# EAGLE board STM32F446 front pane - v3 (EAGLE 9.6.2), part 1 of 4
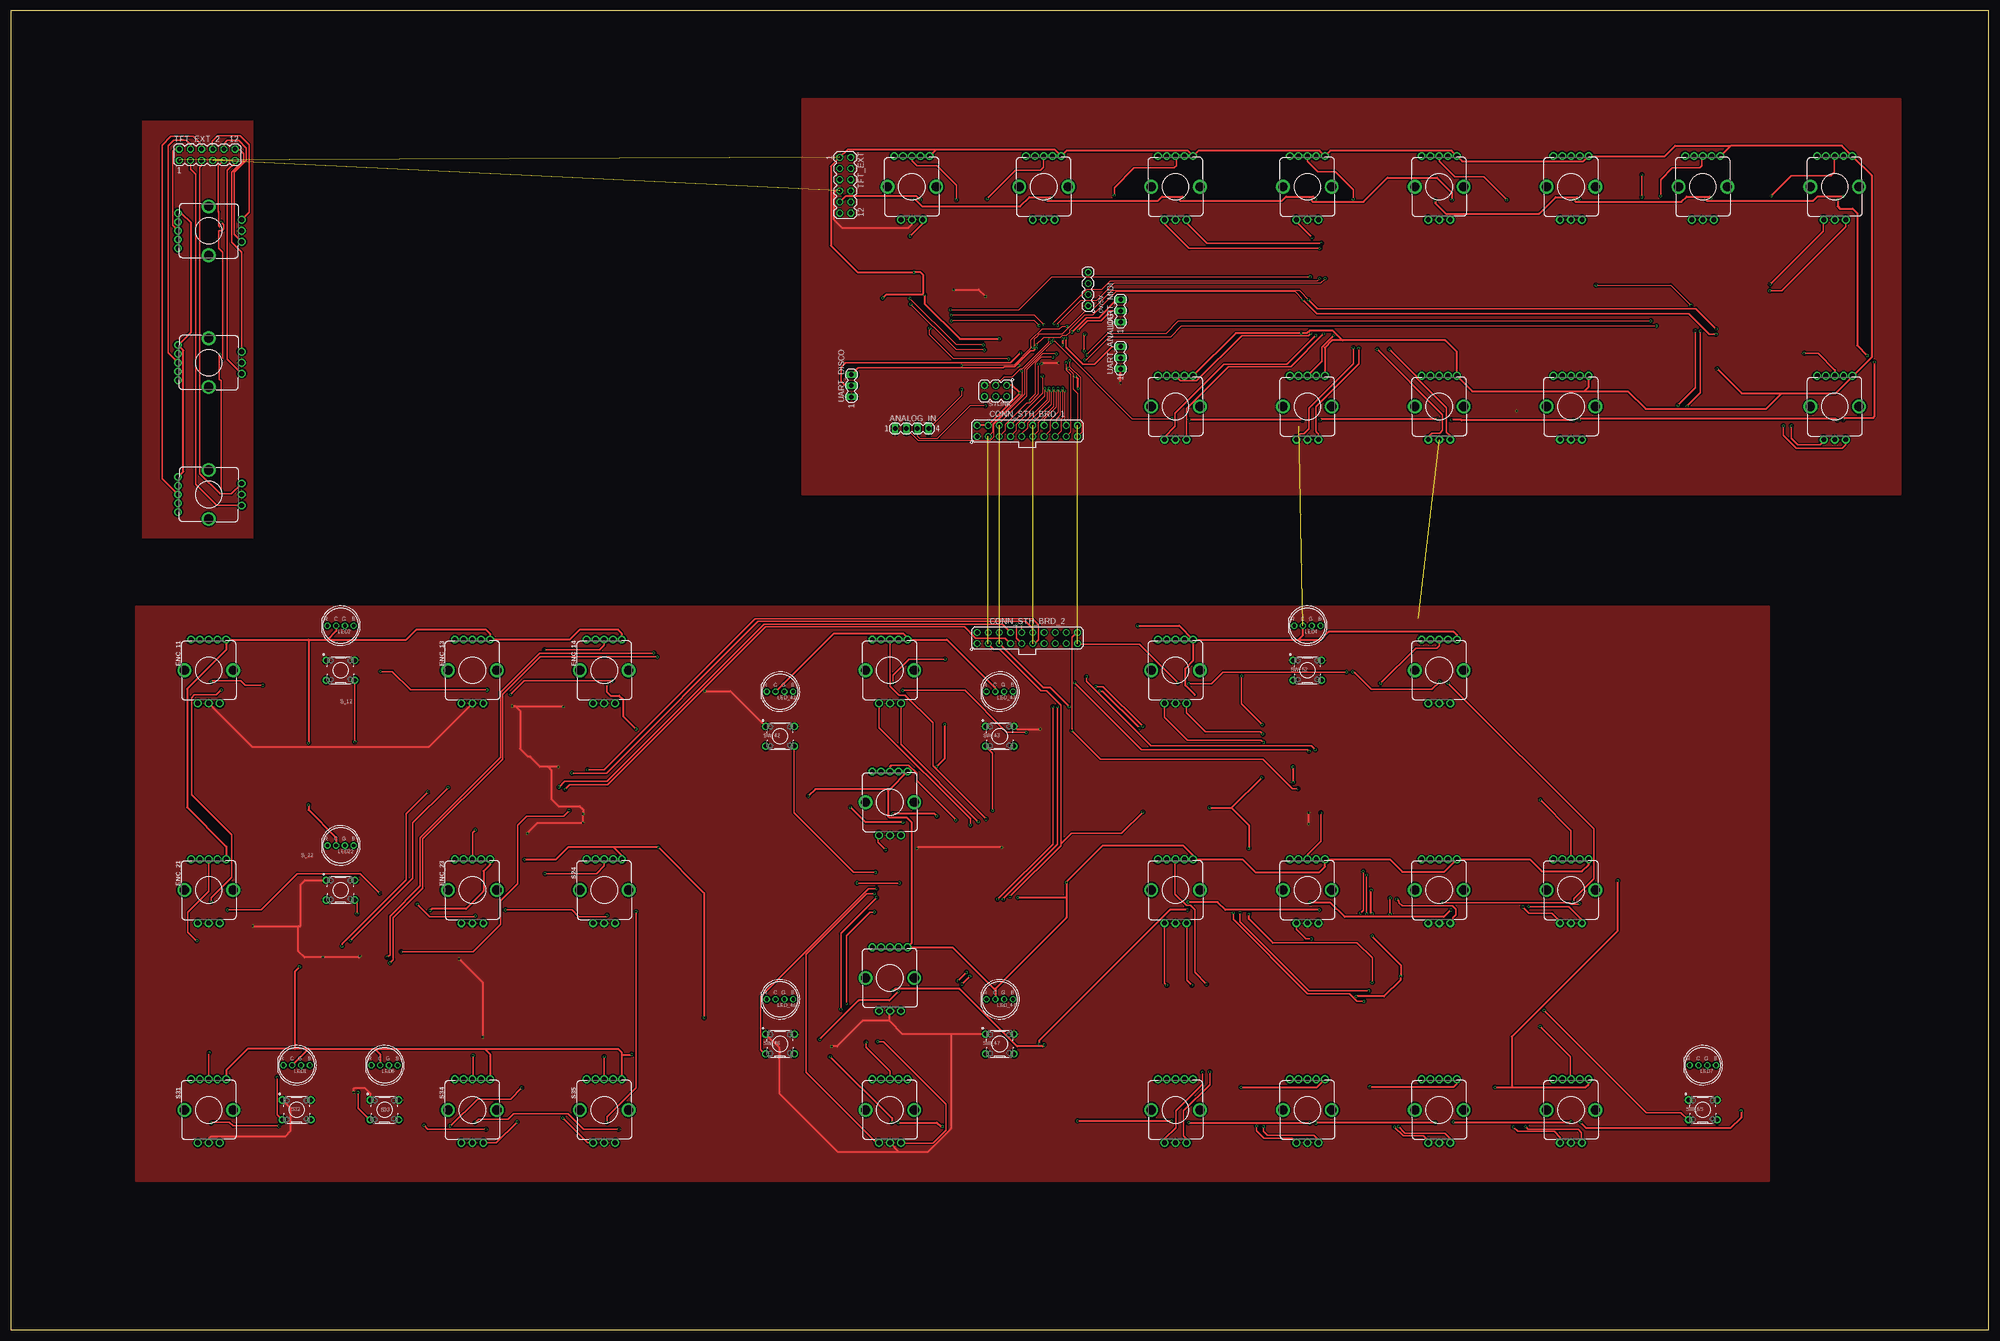
[diagram p15: board, top side]
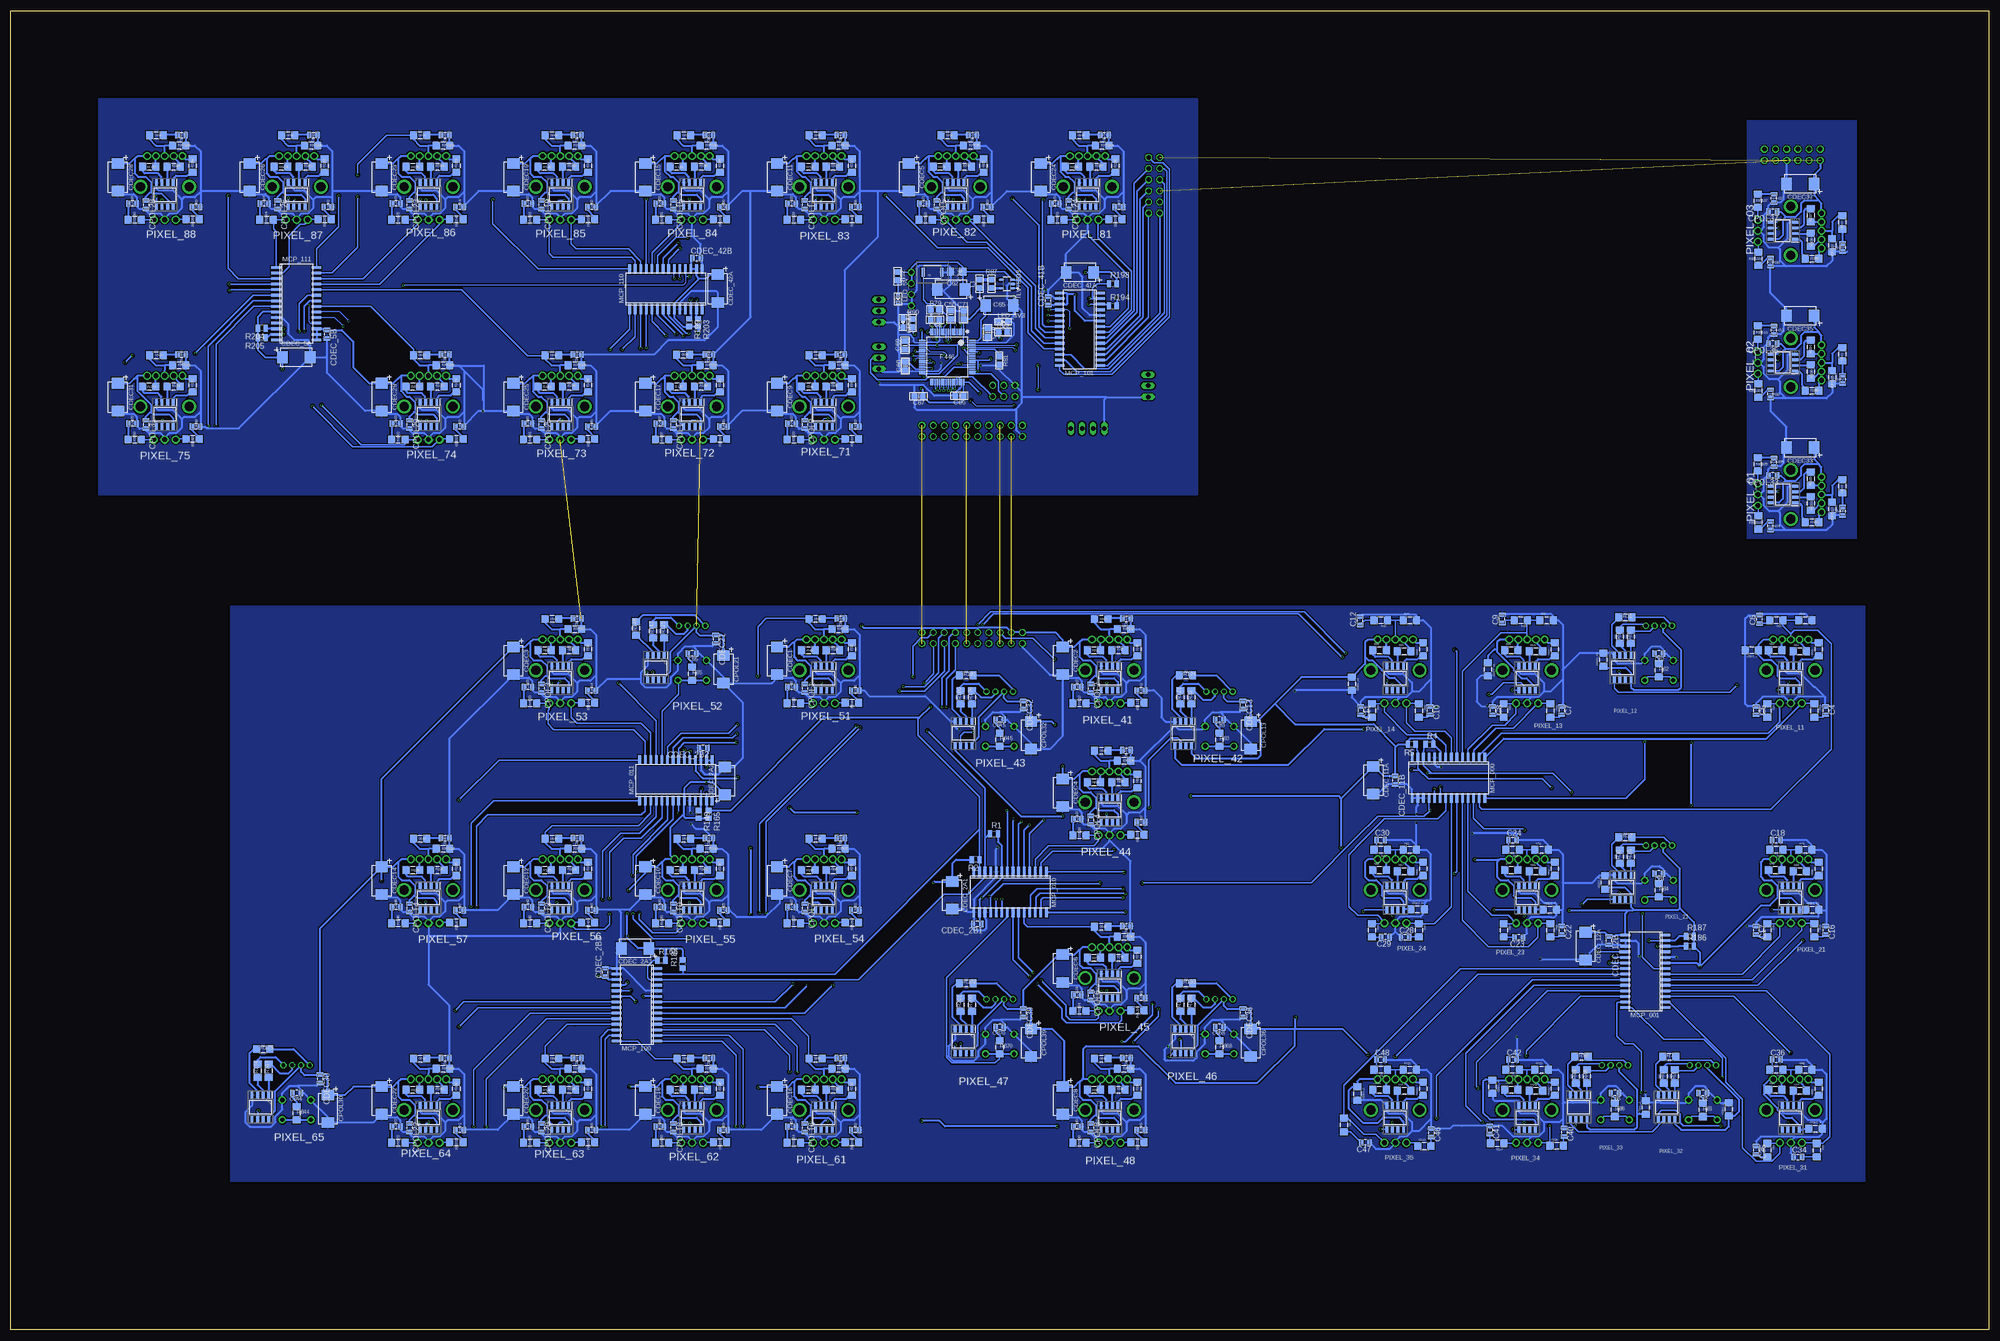
[diagram p16: board, bottom side, seen from below]

Size 450 x 300 mm. Coordinates in mm from the lower left corner, seen from the top.
Outline: 0,0 450,0 450,300 0,300 0,0
Copper layers (1*16): Top 0.035559375mm / dielectric 1.6mm / Bottom 0.035559375mm
Design rules "jlcpcb2layer": minimum track width 5mil, minimum drill 12mil, track to track 5mil, track to pad 5mil, pad to pad 5mil, via to via 5mil, smd to smd 5mil, copper to edge 8mil, drill to drill 6mil, minimum pad ring 5mil, minimum via ring 3mil, stop-mask expansion 2.5mil, vias tented up to drill 0mil, thermal gap 10mil

## Footprints (pad centres in the part's own frame; a part is rotated, then mirrored left to right if it is on the bottom)
MA04-1 = drill 1.016: 1 -3.81,0; 2 -1.27,0; 3 1.27,0; 4 3.81,0
MA04-1' = drill 1.016 long: 1 -3.81,0; 2 -1.27,0; 3 1.27,0; 4 3.81,0
0805-CAP = smd 1 x 1.5: 1 -0.95,0; 2 0.95,0
C0805 = smd 1.3 x 1.5: 1 -0.95,0; 2 0.95,0
CPOL2917 = smd 2.4 x 2.8: + -3.15,0; - 3.15,0
C1206 = smd 1.6 x 1.8: 1 -1.4,0; 2 1.4,0
1206 = smd 1.6 x 1.8: 1 -1.5,0; 2 1.5,0
MA10-2 = drill 1.016: 1 -11.43,-1.27; 2 -11.43,1.27; 3 -8.89,-1.27; 4 -8.89,1.27; 5 -6.35,-1.27; 6 -6.35,1.27; 7 -3.81,-1.27; 8 -3.81,1.27; 9 -1.27,-1.27; 10 -1.27,1.27; 11 1.27,-1.27; 12 1.27,1.27; 13 3.81,-1.27; 14 3.81,1.27; 15 6.35,-1.27; 16 6.35,1.27; 17 8.89,-1.27; 18 8.89,1.27; 19 11.43,-1.27; 20 11.43,1.27
ENCODER_LED_3 = drill 1.1 pad 1.778: 1 -4,7; 2 -2,7; 3 0,7; 4 2,7; 5 4,7 | drill 1.1 pad 1.8: A -2.5,-7.5; B 2.5,-7.5; C 0,-7.5 | drill 2.1: M1 -5.55,0; M2 5.55,0
QFP50P1200X1200X160-64N = smd 1.5 x 0.3: 1 -5.7,3.75; 2 -5.7,3.25; 3 -5.7,2.75; 4 -5.7,2.25; 5 -5.7,1.75; 6 -5.7,1.25; 7 -5.7,0.75; 8 -5.7,0.25; 9 -5.7,-0.25; 10 -5.7,-0.75; 11 -5.7,-1.25; 12 -5.7,-1.75; 13 -5.7,-2.25; 14 -5.7,-2.75; 15 -5.7,-3.25; 16 -5.7,-3.75; 33 5.7,-3.75; 34 5.7,-3.25; 35 5.7,-2.75; 36 5.7,-2.25; 37 5.7,-1.75; 38 5.7,-1.25; 39 5.7,-0.75; 40 5.7,-0.25; 41 5.7,0.25; 42 5.7,0.75; 43 5.7,1.25; 44 5.7,1.75; 45 5.7,2.25; 46 5.7,2.75; 47 5.7,3.25; 48 5.7,3.75 | smd 0.3 x 1.5: 17 -3.75,-5.7; 18 -3.25,-5.7; 19 -2.75,-5.7; 20 -2.25,-5.7; 21 -1.75,-5.7; 22 -1.25,-5.7; 23 -0.75,-5.7; 24 -0.25,-5.7; 25 0.25,-5.7; 26 0.75,-5.7; 27 1.25,-5.7; 28 1.75,-5.7; 29 2.25,-5.7; 30 2.75,-5.7; 31 3.25,-5.7; 32 3.75,-5.7; 49 3.75,5.7; 50 3.25,5.7; 51 2.75,5.7; 52 2.25,5.7; 53 1.75,5.7; 54 1.25,5.7; 55 0.75,5.7; 56 0.25,5.7; 57 -0.25,5.7; 58 -0.75,5.7; 59 -1.25,5.7; 60 -1.75,5.7; 61 -2.25,5.7; 62 -2.75,5.7; 63 -3.25,5.7; 64 -3.75,5.7
0805-LED = smd 1.2 x 1.2: A -1.05,0; C 1.05,0
L0805 = smd 1.3 x 1.5: 1 -0.95,0; 2 0.95,0
LED4-2.0-D8.0MM = drill 0.85 pad 1.4: 1 3,0; 2 1,0; 3 -1,0; 4 -3,0
0603-LED = smd 0.8 x 1: A 0.825,0; C -0.825,0
SOIC-28 = smd 2.2 x 0.6: 1 -4.6,8.255; 2 -4.6,6.985; 3 -4.6,5.715; 4 -4.6,4.445; 5 -4.6,3.175; 6 -4.6,1.905; 7 -4.6,0.635; 8 -4.6,-0.635; 9 -4.6,-1.905; 10 -4.6,-3.175; 11 -4.6,-4.445; 12 -4.6,-5.715; 13 -4.6,-6.985; 14 -4.6,-8.255; 15 4.6,-8.255; 16 4.6,-6.985; 17 4.6,-5.715; 18 4.6,-4.445; 19 4.6,-3.175; 20 4.6,-1.905; 21 4.6,-0.635; 22 4.6,0.635; 23 4.6,1.905; 24 4.6,3.175; 25 4.6,4.445; 26 4.6,5.715; 27 4.6,6.985; 28 4.6,8.255
SOIC127P600X175-8N = smd 1.528 x 0.65: 1 -2.711,1.905; 2 -2.711,0.635; 3 -2.711,-0.635; 4 -2.711,-1.905; 5 2.711,-1.905; 6 2.711,-0.635; 7 2.711,0.635; 8 2.711,1.905
R0805 = smd 1.016 x 1.422: 1 -0.889,0; 2 0.889,0
R0805' = smd 1.3 x 1.5: 1 -0.95,0; 2 0.95,0
SKRKAEE020 = smd 0.8 x 2: 1 -2.1,0; 2 2.1,0
B3F-1000 = drill 1 pad 1.6: 1 -3.25,2.25; 2 3.25,2.25; 3 -3.25,-2.25; 4 3.25,-2.25
MA03-2 = drill 1.016: 1 -2.54,-1.27; 2 -2.54,1.27; 3 0,-1.27; 4 0,1.27; 5 2.54,-1.27; 6 2.54,1.27
MA06-2 = drill 1.016 octagon: 1 -6.35,-1.27; 2 -6.35,1.27; 3 -3.81,-1.27; 4 -3.81,1.27; 5 -1.27,-1.27; 6 -1.27,1.27; 7 1.27,-1.27; 8 1.27,1.27; 9 3.81,-1.27; 10 3.81,1.27; 11 6.35,-1.27; 12 6.35,1.27
SOT95P280X145-5N = smd 1.21 x 0.59: 1 -1.255,0.95; 2 -1.255,0; 3 -1.255,-0.95; 4 1.255,-0.95; 5 1.255,0.95
MA03-1 = drill 1.016 long: 1 -2.54,0; 2 0,0; 3 2.54,0

## Placement (x,y rotation side)
0V/5V  [MA04-1]  245.1,236.75 90 top
ANALOG_IN  [MA04-1']  205,205 0 top
C4  10n  [0805-CAP]  37.13,140.86 270 bottom
C5  10n  [0805-CAP]  52.87,140.86 270 bottom
C6  10n  [0805-CAP]  52.08,161.63 90 bottom
C7  10n  [0805-CAP]  97.13,140.86 270 bottom
C8  10n  [0805-CAP]  112.87,140.86 270 bottom
C9  10n  [0805-CAP]  110.63,161.7 90 bottom
C10  10n  [0805-CAP]  127.13,140.86 270 bottom
C11  10n  [0805-CAP]  142.87,140.86 270 bottom
C12  10n  [0805-CAP]  143.01,161.29 90 bottom
C16  10n  [0805-CAP]  37.13,90.86 270 bottom
C17  10n  [0805-CAP]  52.87,90.86 270 bottom
C18  10n  [0805-CAP]  48.3,111.43 0 bottom
C22  10n  [0805-CAP]  97.13,90.86 270 bottom
C23  10n  [0805-CAP]  106.88,89.25 180 bottom
C24  10n  [0805-CAP]  108.3,111.43 0 bottom
C28  10n  [0805-CAP]  132.77,89.28 0 bottom
C29  10n  [0805-CAP]  137.24,89.28 180 bottom
C30  10n  [0805-CAP]  138.3,111.43 0 bottom
C34  10n  [0805-CAP]  43.4,39.33 0 bottom
C35  10n  [0805-CAP]  52.87,40.86 270 bottom
C36  10n  [0805-CAP]  48.3,61.43 0 bottom
C40  10n  [0805-CAP]  96.62,44.92 270 bottom
C41  10n  [0805-CAP]  113.51,45.43 270 bottom
C42  10n  [0805-CAP]  108.3,61.43 0 bottom
C46  10n  [0805-CAP]  126.87,44.79 270 bottom
C47  10n  [0805-CAP]  141.77,42.54 180 bottom
C48  10n  [0805-CAP]  138.3,61.43 0 bottom
C55  0.1uF  [C0805]  236.1,230.89 270 bottom
C60  2.2uF  [C0805]  246.48,219.24 90 bottom
C62  10u  [CPOL2917]  236.05,236.65 180 bottom
C65  100 uF  [CPOL2917]  225.07,233.02 0 bottom
C66  0.1uF  [C0805]  234.19,212.46 0 bottom
C67  0.1uF  [C0805]  243.46,212.38 0 bottom
C68  0.1uF  [C0805]  239.72,229.78 180 bottom
C69  0.1uF  [C0805]  246.55,223.96 90 bottom
C70  0.1uF  [C0805]  227.77,226.86 90 bottom
C71  1.0uF  [C0805]  233.22,230.83 270 bottom
C76  1u  [C1206]  234.81,240.69 0 bottom
CB1  10n  [0805-CAP]  65,53.81 180 bottom
CB2  10n  [0805-CAP]  75,153.81 180 bottom
CB3  10n  [0805-CAP]  175,138.81 180 bottom
CB4  10n  [0805-CAP]  75,103.81 180 bottom
CB5  10n  [0805-CAP]  295,153.81 180 bottom
CB6  10n  [0805-CAP]  85,53.81 180 bottom
CB8  10n  [0805-CAP]  257.89,145.43 180 bottom
CB9  10n  [0805-CAP]  272.37,146.19 180 bottom
CB10  10n  [0805-CAP]  261.19,161.81 0 bottom
CB11  10n  [0805-CAP]  192.89,145.43 180 bottom
CB12  10n  [0805-CAP]  207.37,146.19 180 bottom
CB13  10n  [0805-CAP]  196.19,161.81 0 bottom
CB14  10n  [0805-CAP]  317.89,145.43 180 bottom
CB15  10n  [0805-CAP]  332.37,146.19 180 bottom
CB16  10n  [0805-CAP]  321.19,161.81 0 bottom
CB17  10n  [0805-CAP]  192.89,115.43 180 bottom
CB18  10n  [0805-CAP]  207.37,116.19 180 bottom
CB19  10n  [0805-CAP]  196.19,131.81 0 bottom
CB20  10n  [0805-CAP]  227.89,255.43 180 bottom
CB21  10n  [0805-CAP]  242.37,256.19 180 bottom
CB22  10n  [0805-CAP]  231.19,271.81 0 bottom
CB23  10n  [0805-CAP]  192.89,75.43 180 bottom
CB24  10n  [0805-CAP]  207.37,76.19 180 bottom
CB25  10n  [0805-CAP]  196.19,91.81 0 bottom
CB26  10n  [0805-CAP]  257.89,95.43 180 bottom
CB27  10n  [0805-CAP]  272.37,96.19 180 bottom
CB28  10n  [0805-CAP]  261.19,111.81 0 bottom
CB29  10n  [0805-CAP]  192.89,45.43 180 bottom
CB30  10n  [0805-CAP]  207.37,46.19 180 bottom
CB31  10n  [0805-CAP]  196.19,61.81 0 bottom
CB32  10n  [0805-CAP]  257.89,205.43 180 bottom
CB33  10n  [0805-CAP]  272.37,206.19 180 bottom
CB34  10n  [0805-CAP]  261.19,221.81 0 bottom
CB35  10n  [0805-CAP]  287.89,95.43 180 bottom
CB36  10n  [0805-CAP]  302.37,96.19 180 bottom
CB37  10n  [0805-CAP]  291.19,111.81 0 bottom
CB38  10n  [0805-CAP]  257.89,255.43 180 bottom
CB39  10n  [0805-CAP]  272.37,256.19 180 bottom
CB40  10n  [0805-CAP]  261.19,271.81 0 bottom
CB41  10n  [0805-CAP]  317.89,95.43 180 bottom
CB42  10n  [0805-CAP]  332.37,96.19 180 bottom
CB43  10n  [0805-CAP]  321.19,111.81 0 bottom
CB44  10n  [0805-CAP]  385,53.81 180 bottom
CB45  10n  [0805-CAP]  225,138.81 180 bottom
CB47  10n  [0805-CAP]  347.89,95.43 180 bottom
CB48  10n  [0805-CAP]  362.37,96.19 180 bottom
CB49  10n  [0805-CAP]  351.19,111.81 0 bottom
CB50  10n  [0805-CAP]  287.89,255.43 180 bottom
CB51  10n  [0805-CAP]  302.37,256.19 180 bottom
CB52  10n  [0805-CAP]  291.19,271.81 0 bottom
CB53  10n  [0805-CAP]  257.89,45.43 180 bottom
CB54  10n  [0805-CAP]  272.37,46.19 180 bottom
CB55  10n  [0805-CAP]  261.19,61.81 0 bottom
CB56  10n  [0805-CAP]  287.89,205.43 180 bottom
CB57  10n  [0805-CAP]  302.37,206.19 180 bottom
CB58  10n  [0805-CAP]  291.19,221.81 0 bottom
CB59  10n  [0805-CAP]  287.89,45.43 180 bottom
CB60  10n  [0805-CAP]  302.37,46.19 180 bottom
CB61  10n  [0805-CAP]  291.19,61.81 0 bottom
CB62  10n  [0805-CAP]  317.89,255.43 180 bottom
CB63  10n  [0805-CAP]  332.37,256.19 180 bottom
CB64  10n  [0805-CAP]  321.19,271.81 0 bottom
CB65  10n  [0805-CAP]  317.89,45.43 180 bottom
CB66  10n  [0805-CAP]  332.37,46.19 180 bottom
CB67  10n  [0805-CAP]  321.19,61.81 0 bottom
CB68  10n  [0805-CAP]  175,68.81 180 bottom
CB70  10n  [0805-CAP]  225,68.81 180 bottom
CB71  10n  [0805-CAP]  347.89,45.43 180 bottom
CB72  10n  [0805-CAP]  362.37,46.19 180 bottom
CB73  10n  [0805-CAP]  351.19,61.81 0 bottom
CB74  10n  [0805-CAP]  347.89,255.43 180 bottom
CB75  10n  [0805-CAP]  362.37,256.19 180 bottom
CB76  10n  [0805-CAP]  351.19,271.81 0 bottom
CB77  10n  [0805-CAP]  197.89,255.43 180 bottom
CB78  10n  [0805-CAP]  212.37,256.19 180 bottom
CB79  10n  [0805-CAP]  201.19,271.81 0 bottom
CB80  10n  [0805-CAP]  317.89,205.43 180 bottom
CB81  10n  [0805-CAP]  332.37,206.19 180 bottom
CB82  10n  [0805-CAP]  321.19,221.81 0 bottom
CB83  10n  [0805-CAP]  377.89,255.43 180 bottom
CB84  10n  [0805-CAP]  392.37,256.19 180 bottom
CB85  10n  [0805-CAP]  381.19,271.81 0 bottom
CB89  10n  [0805-CAP]  407.89,255.43 180 bottom
CB90  10n  [0805-CAP]  422.37,256.19 180 bottom
CB91  10n  [0805-CAP]  411.19,271.81 0 bottom
CB92  10n  [0805-CAP]  347.89,205.43 180 bottom
CB93  10n  [0805-CAP]  362.37,206.19 180 bottom
CB94  10n  [0805-CAP]  351.19,221.81 0 bottom
CB98  10n  [0805-CAP]  407.89,205.43 180 bottom
CB99  10n  [0805-CAP]  422.37,206.19 180 bottom
CB100  10n  [0805-CAP]  411.19,221.81 0 bottom
CB104  10n  [0805-CAP]  49.57,182.89 90 bottom
CB105  10n  [0805-CAP]  48.81,197.37 90 bottom
CB106  10n  [0805-CAP]  33.19,186.19 270 bottom
CB110  10n  [0805-CAP]  49.57,212.89 90 bottom
CB111  10n  [0805-CAP]  48.81,227.37 90 bottom
CB112  10n  [0805-CAP]  33.19,216.19 270 bottom
CB116  10n  [0805-CAP]  49.57,242.89 90 bottom
CB117  10n  [0805-CAP]  48.81,257.37 90 bottom
CB118  10n  [0805-CAP]  33.19,246.19 270 bottom
CDEC1  10u  [CPOL2917]  275.67,152.16 270 bottom
CDEC2  10u  [CPOL2917]  210.67,152.16 270 bottom
CDEC3  10u  [CPOL2917]  335.67,152.16 270 bottom
CDEC4  10u  [CPOL2917]  210.67,122.16 270 bottom
CDEC5  10u  [CPOL2917]  245.67,262.16 270 bottom
CDEC6  10u  [CPOL2917]  210.67,82.16 270 bottom
CDEC7  10u  [CPOL2917]  275.67,102.16 270 bottom
CDEC8  10u  [CPOL2917]  210.67,52.16 270 bottom
CDEC9  10u  [CPOL2917]  275.67,212.16 270 bottom
CDEC10  10u  [CPOL2917]  305.67,102.16 270 bottom
CDEC11  10u  [CPOL2917]  275.67,262.16 270 bottom
CDEC12  10u  [CPOL2917]  335.67,102.16 270 bottom
CDEC13  100n  [0805-CAP]  169.67,142.11 270 bottom
CDEC14  10u  [CPOL2917]  365.67,102.16 270 bottom
CDEC15  10u  [CPOL2917]  305.67,262.16 270 bottom
CDEC16  10u  [CPOL2917]  275.67,52.16 270 bottom
CDEC17  10u  [CPOL2917]  305.67,212.16 270 bottom
CDEC18  10u  [CPOL2917]  305.67,52.16 270 bottom
CDEC19  10u  [CPOL2917]  335.67,262.16 270 bottom
CDEC20  10u  [CPOL2917]  335.67,52.16 270 bottom
CDEC21  100n  [0805-CAP]  289.67,157.11 270 bottom
CDEC22  10u  [CPOL2917]  365.67,52.16 270 bottom
CDEC23  10u  [CPOL2917]  365.67,262.16 270 bottom
CDEC24  10u  [CPOL2917]  215.67,262.16 270 bottom
CDEC25  10u  [CPOL2917]  335.67,212.16 270 bottom
CDEC26  10u  [CPOL2917]  395.67,262.16 270 bottom
CDEC28  10u  [CPOL2917]  425.67,262.16 270 bottom
CDEC29  10u  [CPOL2917]  365.67,212.16 270 bottom
CDEC30  100n  [0805-CAP]  379.67,57.11 270 bottom
CDEC31  10u  [CPOL2917]  425.67,212.16 270 bottom
CDEC32  100n  [0805-CAP]  219.67,142.11 270 bottom
CDEC33  10u  [CPOL2917]  42.84,200.67 180 bottom
CDEC35  10u  [CPOL2917]  42.84,230.67 180 bottom
CDEC36  100n  [0805-CAP]  169.67,72.11 270 bottom
CDEC37  10u  [CPOL2917]  42.84,260.67 180 bottom
CDEC39  100n  [0805-CAP]  219.67,72.11 270 bottom
CDEC_1  100n  [1206]  59.05,50.16 90 bottom
CDEC_2  100n  [1206]  77.98,50.55 90 bottom
CDEC_2A1  10u  [CPOL2917]  235.84,98.81 270 bottom
CDEC_2A2  10u  [CPOL2917]  287.53,124.84 90 bottom
CDEC_2A3  10u  [CPOL2917]  307.98,86.74 180 bottom
CDEC_2B1  100n  [0805-CAP]  230.12,92.33 180 bottom
CDEC_2B2  100n  [0805-CAP]  292.48,132.33 180 bottom
CDEC_2B3  100n  [0805-CAP]  314.71,81.28 90 bottom
CDEC_3  100n  [1206]  39.37,45.72 0 bottom
CDEC_4  100n  [1206]  112.9,55.24 270 bottom
CDEC_5  100n  [1206]  143.64,53.72 270 bottom
CDEC_5A  10u  [CPOL2917]  385.06,221.23 0 bottom
CDEC_5B  100n  [0805-CAP]  378.08,226.44 270 bottom
CDEC_6  100n  [1206]  129.92,95.63 0 bottom
CDEC_7  100n  [1206]  99.82,95.5 0 bottom
CDEC_8  100n  [1206]  87.25,101.73 90 bottom
CDEC_9  100n  [1206]  53.85,154.56 180 bottom
CDEC_10  100n  [1206]  87.63,152.4 90 bottom
CDEC_11  100n  [1206]  113.92,150.24 270 bottom
CDEC_11A  10u  [CPOL2917]  140,125 270 bottom
CDEC_11B  100n  [0805-CAP]  135,125 270 bottom
CDEC_12  100n  [1206]  40.13,95.5 0 bottom
CDEC_12A  10u  [CPOL2917]  91.69,87.26 270 bottom
CDEC_12B  100n  [0805-CAP]  86.4,88.53 270 bottom
CDEC_13  100n  [1206]  144.91,146.94 270 bottom
CDEC_41A  10u  [CPOL2917]  206.76,240.54 180 bottom
CDEC_41B  100n  [0805-CAP]  214,234.06 90 bottom
CDEC_42A  10u  [CPOL2917]  289.18,236.85 270 bottom
CDEC_42B  100n  [0805-CAP]  294,243.84 0 bottom
CONN_STH_BRD_1  [MA10-2]  231.27,204.47 0 top
CONN_STH_BRD_2  [MA10-2]  231.27,157.35 0 top
CPOL1  100n  [0805-CAP]  269.32,145.94 270 bottom
CPOL2  100n  [0805-CAP]  204.32,145.94 270 bottom
CPOL3  100n  [0805-CAP]  329.32,145.94 270 bottom
CPOL4  100n  [0805-CAP]  204.32,115.94 270 bottom
CPOL5  100n  [0805-CAP]  239.32,255.94 270 bottom
CPOL6  100n  [0805-CAP]  204.32,75.94 270 bottom
CPOL7  100n  [0805-CAP]  269.32,95.94 270 bottom
CPOL8  100n  [0805-CAP]  204.32,45.94 270 bottom
CPOL9  100n  [0805-CAP]  269.32,205.94 270 bottom
CPOL10  100n  [0805-CAP]  299.32,95.94 270 bottom
CPOL11  100n  [0805-CAP]  269.32,255.94 270 bottom
CPOL12  100n  [0805-CAP]  329.32,95.94 270 bottom
CPOL13  10u  [CPOL2917]  167.89,135.25 270 bottom
CPOL14  100n  [0805-CAP]  359.32,95.94 270 bottom
CPOL15  100n  [0805-CAP]  299.32,255.94 270 bottom
CPOL16  100n  [0805-CAP]  269.32,45.94 270 bottom
CPOL17  100n  [0805-CAP]  299.32,205.94 270 bottom
CPOL18  100n  [0805-CAP]  299.32,45.94 270 bottom
CPOL19  100n  [0805-CAP]  329.32,255.94 270 bottom
CPOL20  100n  [0805-CAP]  329.32,45.94 270 bottom
CPOL21  10u  [CPOL2917]  287.89,150.25 270 bottom
CPOL22  100n  [0805-CAP]  359.32,45.94 270 bottom
CPOL23  100n  [0805-CAP]  359.32,255.94 270 bottom
CPOL24  100n  [0805-CAP]  209.32,255.94 270 bottom
CPOL25  100n  [0805-CAP]  329.32,205.94 270 bottom
CPOL26  100n  [0805-CAP]  389.32,255.94 270 bottom
CPOL28  100n  [0805-CAP]  419.32,255.94 270 bottom
CPOL29  100n  [0805-CAP]  359.32,205.94 270 bottom
CPOL30  10u  [CPOL2917]  377.89,50.25 270 bottom
CPOL31  100n  [0805-CAP]  419.32,205.94 270 bottom
CPOL32  10u  [CPOL2917]  217.89,135.25 270 bottom
CPOL33  100n  [0805-CAP]  49.06,194.32 180 bottom
CPOL35  100n  [0805-CAP]  49.06,224.32 180 bottom
CPOL36  10u  [CPOL2917]  167.89,65.25 270 bottom
CPOL37  100n  [0805-CAP]  49.06,254.32 180 bottom
CPOL39  10u  [CPOL2917]  217.89,65.25 270 bottom
ENC_01  [ENCODER_LED_3]  45,190 90 top
ENC_02  [ENCODER_LED_3]  45,220 90 top
ENC_3  [ENCODER_LED_3]  45,250 90 top
ENC_11  [ENCODER_LED_3]  45,150 0 top
ENC_13  [ENCODER_LED_3]  105,150 0 top
ENC_14  [ENCODER_LED_3]  135,150 0 top
ENC_21  [ENCODER_LED_3]  45,100 0 top
ENC_23  [ENCODER_LED_3]  105,100 0 top
ENC_41  [ENCODER_LED_3]  200,150 0 top
ENC_44  [ENCODER_LED_3]  200,120 0 top
ENC_45  [ENCODER_LED_3]  200,80 0 top
ENC_48  [ENCODER_LED_3]  200,50 0 top
ENC_51  [ENCODER_LED_3]  265,150 0 top
ENC_53  [ENCODER_LED_3]  325,150 0 top
ENC_54  [ENCODER_LED_3]  265,100 0 top
ENC_55  [ENCODER_LED_3]  295,100 0 top
ENC_56  [ENCODER_LED_3]  325,100 0 top
ENC_57  [ENCODER_LED_3]  355,100 0 top
ENC_61  [ENCODER_LED_3]  265,50 0 top
ENC_62  [ENCODER_LED_3]  295,50 0 top
ENC_63  [ENCODER_LED_3]  325,50 0 top
ENC_64  [ENCODER_LED_3]  355,50 0 top
ENC_71  [ENCODER_LED_3]  265,210 0 top
ENC_72  [ENCODER_LED_3]  295,210 0 top
ENC_73  [ENCODER_LED_3]  325,210 0 top
ENC_74  [ENCODER_LED_3]  355,210 0 top
ENC_75  [ENCODER_LED_3]  415,210 0 top
ENC_81  [ENCODER_LED_3]  205,260 0 top
ENC_82  [ENCODER_LED_3]  235,260 0 top
ENC_83  [ENCODER_LED_3]  265,260 0 top
ENC_84  [ENCODER_LED_3]  295,260 0 top
ENC_85  [ENCODER_LED_3]  325,260 0 top
ENC_86  [ENCODER_LED_3]  355,260 0 top
ENC_87  [ENCODER_LED_3]  385,260 0 top
ENC_88  [ENCODER_LED_3]  415,260 0 top
F446  STM32F446RCT7  [QFP50P1200X1200X160-64N]  236.97,221.26 270 bottom
GREEN  [0805-LED]  247.01,229.13 270 bottom
L1  1 uH  [L0805]  229.63,237.94 270 bottom
LED1  CZXR-80RGB03-A  [LED4-2.0-D8.0MM]  65,60.16 180 top
LED2  CZXR-80RGB03-A  [LED4-2.0-D8.0MM]  75,160.16 180 top
LED4  CZXR-80RGB03-A  [LED4-2.0-D8.0MM]  295,160.16 180 top
LED6  CZXR-80RGB03-A  [LED4-2.0-D8.0MM]  85,60.16 180 top
LED7  CZXR-80RGB03-A  [LED4-2.0-D8.0MM]  385,60.16 180 top
LED22  CZXR-80RGB03-A  [LED4-2.0-D8.0MM]  75,110.16 180 top
LED_3V3  [0805-LED]  224.27,229.26 0 bottom
LED_5V  [0603-LED]  248.15,234.47 90 bottom
LED_42  CZXR-80RGB03-A  [LED4-2.0-D8.0MM]  175,145.16 180 top
LED_43  CZXR-80RGB03-A  [LED4-2.0-D8.0MM]  225,145.16 180 top
LED_46  CZXR-80RGB03-A  [LED4-2.0-D8.0MM]  175,75.16 180 top
LED_47  CZXR-80RGB03-A  [LED4-2.0-D8.0MM]  225,75.16 180 top
MCP_000  MCP23017  [SOIC-28]  122.87,125.54 270 bottom
MCP_001  MCP23017  [SOIC-28]  78.05,81.53 180 bottom
MCP_010  MCP23017  [SOIC-28]  222.63,99.57 270 bottom
MCP_011  MCP23017  [SOIC-28]  298.7,124.97 90 bottom
MCP_100  MCP23017  [SOIC-28]  307.59,73.91 180 bottom
MCP_101  MCP23017  [SOIC-28]  206.76,227.58 180 bottom
MCP_110  MCP23017  [SOIC-28]  300.99,236.73 90 bottom
MCP_111  MCP23017  [SOIC-28]  385.06,233.43 0 bottom
PIXE_82  NEOPIXEL-TLC59731DR  [SOIC127P600X175-8N]  235,258.22 270 bottom
PIXEL_01  NEOPIXEL-TLC59731DR  [SOIC127P600X175-8N]  46.78,190 180 bottom
PIXEL_02  NEOPIXEL-TLC59731DR  [SOIC127P600X175-8N]  46.78,220 180 bottom
PIXEL_03  NEOPIXEL-TLC59731DR  [SOIC127P600X175-8N]  46.78,250 180 bottom
PIXEL_11  NEOPIXEL-TLC59731DR  [SOIC127P600X175-8N]  45,148.22 270 bottom
PIXEL_12  NEOPIXEL-TLC59731DR  [SOIC127P600X175-8N]  83.25,150.63 270 bottom
PIXEL_13  NEOPIXEL-TLC59731DR  [SOIC127P600X175-8N]  105,148.22 270 bottom
PIXEL_14  NEOPIXEL-TLC59731DR  [SOIC127P600X175-8N]  135,148.22 270 bottom
PIXEL_21  NEOPIXEL-TLC59731DR  [SOIC127P600X175-8N]  45,98.22 270 bottom
PIXEL_22  NEOPIXEL-TLC59731DR  [SOIC127P600X175-8N]  83.25,100.64 270 bottom
PIXEL_23  NEOPIXEL-TLC59731DR  [SOIC127P600X175-8N]  105,98.22 270 bottom
PIXEL_24  NEOPIXEL-TLC59731DR  [SOIC127P600X175-8N]  135,98.22 270 bottom
PIXEL_31  NEOPIXEL-TLC59731DR  [SOIC127P600X175-8N]  45,48.22 270 bottom
PIXEL_32  NEOPIXEL-TLC59731DR  [SOIC127P600X175-8N]  73.25,50.63 270 bottom
PIXEL_33  NEOPIXEL-TLC59731DR  [SOIC127P600X175-8N]  93.25,50.63 270 bottom
PIXEL_34  NEOPIXEL-TLC59731DR  [SOIC127P600X175-8N]  105,48.22 270 bottom
PIXEL_35  NEOPIXEL-TLC59731DR  [SOIC127P600X175-8N]  135,48.22 270 bottom
PIXEL_41  NEOPIXEL-TLC59731DR  [SOIC127P600X175-8N]  200,148.22 270 bottom
PIXEL_42  NEOPIXEL-TLC59731DR  [SOIC127P600X175-8N]  183.25,135.63 270 bottom
PIXEL_43  NEOPIXEL-TLC59731DR  [SOIC127P600X175-8N]  233.25,135.63 270 bottom
PIXEL_44  NEOPIXEL-TLC59731DR  [SOIC127P600X175-8N]  200,118.22 270 bottom
PIXEL_45  NEOPIXEL-TLC59731DR  [SOIC127P600X175-8N]  200,78.22 270 bottom
PIXEL_46  NEOPIXEL-TLC59731DR  [SOIC127P600X175-8N]  183.25,65.64 270 bottom
PIXEL_47  NEOPIXEL-TLC59731DR  [SOIC127P600X175-8N]  233.25,65.64 270 bottom
PIXEL_48  NEOPIXEL-TLC59731DR  [SOIC127P600X175-8N]  200,48.22 270 bottom
PIXEL_51  NEOPIXEL-TLC59731DR  [SOIC127P600X175-8N]  265,148.22 270 bottom
PIXEL_52  NEOPIXEL-TLC59731DR  [SOIC127P600X175-8N]  303.25,150.63 270 bottom
PIXEL_53  NEOPIXEL-TLC59731DR  [SOIC127P600X175-8N]  325,148.22 270 bottom
PIXEL_54  NEOPIXEL-TLC59731DR  [SOIC127P600X175-8N]  265,98.22 270 bottom
PIXEL_55  NEOPIXEL-TLC59731DR  [SOIC127P600X175-8N]  295,98.22 270 bottom
PIXEL_56  NEOPIXEL-TLC59731DR  [SOIC127P600X175-8N]  325,98.22 270 bottom
PIXEL_57  NEOPIXEL-TLC59731DR  [SOIC127P600X175-8N]  355,98.22 270 bottom
PIXEL_61  NEOPIXEL-TLC59731DR  [SOIC127P600X175-8N]  265,48.22 270 bottom
PIXEL_62  NEOPIXEL-TLC59731DR  [SOIC127P600X175-8N]  295,48.22 270 bottom
PIXEL_63  NEOPIXEL-TLC59731DR  [SOIC127P600X175-8N]  325,48.22 270 bottom
PIXEL_64  NEOPIXEL-TLC59731DR  [SOIC127P600X175-8N]  355,48.22 270 bottom
PIXEL_65  NEOPIXEL-TLC59731DR  [SOIC127P600X175-8N]  393.25,50.63 270 bottom
PIXEL_71  NEOPIXEL-TLC59731DR  [SOIC127P600X175-8N]  265,208.22 270 bottom
PIXEL_72  NEOPIXEL-TLC59731DR  [SOIC127P600X175-8N]  295,208.22 270 bottom
PIXEL_73  NEOPIXEL-TLC59731DR  [SOIC127P600X175-8N]  325,208.22 270 bottom
PIXEL_74  NEOPIXEL-TLC59731DR  [SOIC127P600X175-8N]  355,208.22 270 bottom
PIXEL_75  NEOPIXEL-TLC59731DR  [SOIC127P600X175-8N]  415,208.22 270 bottom
PIXEL_81  NEOPIXEL-TLC59731DR  [SOIC127P600X175-8N]  205,258.22 270 bottom
PIXEL_83  NEOPIXEL-TLC59731DR  [SOIC127P600X175-8N]  265,258.22 270 bottom
PIXEL_84  NEOPIXEL-TLC59731DR  [SOIC127P600X175-8N]  295,258.22 270 bottom
PIXEL_85  NEOPIXEL-TLC59731DR  [SOIC127P600X175-8N]  325,258.22 270 bottom
PIXEL_86  NEOPIXEL-TLC59731DR  [SOIC127P600X175-8N]  355,258.22 270 bottom
PIXEL_87  NEOPIXEL-TLC59731DR  [SOIC127P600X175-8N]  385,258.22 270 bottom
PIXEL_88  NEOPIXEL-TLC59731DR  [SOIC127P600X175-8N]  415,258.22 270 bottom
R1  1k  [R0805]  226.31,112.78 0 bottom
R2  1k  [R0805]  230.5,106.93 180 bottom
R3  100  [1206]  71.35,57.62 90 bottom
R4  1k  [R0805]  127.19,133.16 0 bottom
R5  1k  [R0805]  131.25,133.16 180 bottom
R6  100  [1206]  73.89,57.62 90 bottom
R7  100  [1206]  72.62,62.06 0 bottom
R8  100  [1206]  81.35,157.62 90 bottom
R9  100  [1206]  83.89,157.62 90 bottom
R10  100  [1206]  38.65,154.83 90 bottom
R11  100  [1206]  42.97,154.32 0 bottom
R12  100  [1206]  48.56,154.57 0 bottom
R13  10k  [1206]  41.7,161.43 0 bottom
R14  470  [1206]  39.67,140.86 270 bottom
R15  470  [1206]  50.33,140.86 270 bottom
R16  470  [1206]  48.3,161.43 180 bottom
R17  100  [1206]  98.65,154.83 90 bottom
R18  100  [1206]  102.97,154.32 0 bottom
R19  100  [1206]  108.56,154.57 0 bottom
R20  10k  [1206]  100.56,161.43 0 bottom
R21  470  [1206]  99.67,140.86 270 bottom
R22  470  [1206]  110.33,140.86 270 bottom
R23  470  [1206]  106.4,161.43 180 bottom
R24  100  [1206]  128.65,154.83 90 bottom
R25  100  [1206]  132.97,154.32 0 bottom
R26  100  [1206]  138.56,154.57 0 bottom
R27  10k  [1206]  131.7,161.43 0 bottom
R28  470  [1206]  129.67,140.86 270 bottom
R29  470  [1206]  140.33,140.86 270 bottom
R30  470  [1206]  138.3,161.43 180 bottom
R31  100  [1206]  82.62,162.06 0 bottom
R32  100  [1206]  181.35,143.89 90 bottom
R33  100  [1206]  258.65,154.83 90 bottom
R34  100  [1206]  262.97,154.57 0 bottom
R35  100  [1206]  81.35,107.62 90 bottom
R36  100  [1206]  83.89,107.62 90 bottom
R37  100  [1206]  82.62,112.06 0 bottom
R38  100  [1206]  38.65,104.83 90 bottom
R39  100  [1206]  42.97,104.32 0 bottom
R40  100  [1206]  48.56,104.57 0 bottom
R41  10k  [1206]  41.7,109.14 0 bottom
R42  470  [1206]  39.67,90.86 270 bottom
R43  470  [1206]  50.33,90.86 270 bottom
R44  470  [1206]  48.3,109.14 180 bottom
R45  100  [1206]  268.56,154.57 0 bottom
R46  100  [1206]  193.65,154.83 90 bottom
R47  100  [1206]  197.97,154.57 0 bottom
R48  100  [1206]  91.35,57.62 90 bottom
R49  100  [1206]  93.89,57.62 90 bottom
R50  100  [1206]  92.62,62.06 0 bottom
R51  100  [1206]  203.56,154.57 0 bottom
R52  100  [1206]  98.65,104.83 90 bottom
R53  100  [1206]  102.97,104.32 0 bottom
R54  100  [1206]  108.56,104.57 0 bottom
R55  10k  [1206]  101.7,109.14 0 bottom
R56  470  [1206]  99.67,90.86 270 bottom
R57  470  [1206]  110.33,90.86 270 bottom
R58  470  [1206]  108.3,109.14 180 bottom
R59  100  [1206]  318.65,154.83 90 bottom
R60  100  [1206]  322.97,154.57 0 bottom
R61  100  [1206]  328.56,154.57 0 bottom
R62  100  [1206]  193.65,124.83 90 bottom
R63  100  [1206]  197.97,124.57 0 bottom
R64  100  [1206]  203.56,124.57 0 bottom
R65  100  [1206]  228.65,264.83 90 bottom
R66  100  [1206]  128.65,104.83 90 bottom
R67  100  [1206]  132.97,104.32 0 bottom
R68  100  [1206]  138.56,104.57 0 bottom
R69  10k  [1206]  131.7,109.14 0 bottom
R70  470  [1206]  129.67,90.86 270 bottom
R71  470  [1206]  140.33,90.86 270 bottom
R72  470  [1206]  138.3,109.14 180 bottom
R73  100  [1206]  232.97,264.57 0 bottom
R74  100  [1206]  238.56,264.57 0 bottom
R75  100  [1206]  193.65,84.83 90 bottom
R76  100  [1206]  197.97,84.57 0 bottom
R77  100  [1206]  203.56,84.57 0 bottom
R78  100  [1206]  258.65,104.83 90 bottom
R79  100k  [R0805']  239.77,232.05 0 bottom
R80  100  [1206]  262.97,104.57 0 bottom
R81  10K  [R0805']  225.12,220.48 270 bottom
R82  100  [1206]  38.65,54.83 90 bottom
R83  100  [1206]  268.56,104.57 0 bottom
R84  100  [1206]  42.97,54.32 0 bottom
R85  100  [1206]  48.56,54.57 0 bottom
R86  100  [1206]  193.65,54.83 90 bottom
R87  1  [R0805']  226.88,237.94 270 bottom
R88  10k  [1206]  41.7,59.14 0 bottom
R89  470  [1206]  39.03,40.86 270 bottom
R90  1k  [R0805']  244.85,229 90 bottom
R91  470  [1206]  50.33,40.86 270 bottom
R92  470  [R0805']  248.28,239.67 270 bottom
R93  470  [1206]  48.3,59.14 180 bottom
R94  100  [1206]  197.97,54.57 0 bottom
R95  1k  [R0805']  224.27,226.97 0 bottom
R96  100  [1206]  203.56,54.57 0 bottom
R97  100  [1206]  258.65,214.83 90 bottom
R98  100  [1206]  262.97,214.57 0 bottom
R99  100  [1206]  268.56,214.57 0 bottom
R100  100  [1206]  288.65,104.83 90 bottom
R101  100  [1206]  292.97,104.57 0 bottom
R102  100  [1206]  98.65,54.83 90 bottom
R103  100  [1206]  102.97,54.32 0 bottom
R104  100  [1206]  108.56,54.57 0 bottom
R105  10k  [1206]  101.7,59.14 0 bottom
R106  470  [1206]  98.26,41.81 0 bottom
R107  470  [1206]  111.8,42.39 180 bottom
R108  470  [1206]  108.3,59.14 180 bottom
R109  100  [1206]  298.56,104.57 0 bottom
R110  100  [1206]  258.65,264.83 90 bottom
R111  100  [1206]  262.97,264.57 0 bottom
R112  100  [1206]  268.56,264.57 0 bottom
R113  100  [1206]  318.65,104.83 90 bottom
R114  100  [1206]  322.97,104.57 0 bottom
R115  100  [1206]  328.56,104.57 0 bottom
R116  100  [1206]  128.65,54.83 90 bottom
R117  100  [1206]  132.97,54.32 0 bottom
R118  100  [1206]  138.56,54.57 0 bottom
R119  10k  [1206]  131.7,59.14 0 bottom
R120  470  [1206]  128.36,41.78 0 bottom
R121  470  [1206]  146.68,46.57 270 bottom
R122  470  [1206]  138.3,59.14 180 bottom
R123  100  [1206]  183.89,143.89 90 bottom
R124  100  [1206]  182.62,148.84 0 bottom
R125  100  [1206]  301.35,158.89 90 bottom
R126  100  [1206]  348.65,104.83 90 bottom
R127  100  [1206]  352.97,104.57 0 bottom
R128  100  [1206]  358.56,104.57 0 bottom
R129  100  [1206]  288.65,264.83 90 bottom
R130  100  [1206]  292.97,264.57 0 bottom
R131  100  [1206]  298.56,264.57 0 bottom
R132  100  [1206]  258.65,54.83 90 bottom
R133  100  [1206]  262.97,54.57 0 bottom
R134  100  [1206]  268.56,54.57 0 bottom
R135  100  [1206]  288.65,214.83 90 bottom
R136  100  [1206]  292.97,214.57 0 bottom
R137  100  [1206]  298.56,214.57 0 bottom
R138  100  [1206]  288.65,54.83 90 bottom
R139  100  [1206]  292.97,54.57 0 bottom
R140  100  [1206]  298.56,54.57 0 bottom
R141  100  [1206]  318.65,264.83 90 bottom
R142  100  [1206]  322.97,264.57 0 bottom
R143  100  [1206]  328.56,264.57 0 bottom
R144  100  [1206]  318.65,54.83 90 bottom
R145  100  [1206]  322.97,54.57 0 bottom
R146  100  [1206]  328.56,54.57 0 bottom
R147  100  [1206]  303.89,158.89 90 bottom
R148  100  [1206]  307.73,159.53 90 bottom
R149  1k  [R0805]  293.5,117.22 270 bottom
R150  100  [1206]  348.65,54.83 90 bottom
R151  100  [1206]  352.97,54.57 0 bottom
R152  100  [1206]  358.56,54.57 0 bottom
R153  100  [1206]  348.65,264.83 90 bottom
R154  100  [1206]  352.97,264.57 0 bottom
R155  100  [1206]  358.56,264.57 0 bottom
R156  100  [1206]  198.65,264.83 90 bottom
R157  100  [1206]  202.97,264.57 0 bottom
R158  100  [1206]  208.56,264.57 0 bottom
R159  100  [1206]  318.65,214.83 90 bottom
R160  100  [1206]  322.97,214.57 0 bottom
R161  100  [1206]  328.56,214.57 0 bottom
R162  100  [1206]  378.65,264.83 90 bottom
R163  100  [1206]  382.97,264.57 0 bottom
R164  100  [1206]  388.56,264.57 0 bottom
R165  1k  [R0805]  291.21,117.22 270 bottom
R166  1k  [R0805]  302.01,84.07 0 bottom
R167  100  [1206]  391.35,58.89 90 bottom
R168  100  [1206]  408.65,264.83 90 bottom
R169  100  [1206]  412.97,264.57 0 bottom
R170  100  [1206]  418.56,264.57 0 bottom
R171  100  [1206]  348.65,214.83 90 bottom
R172  100  [1206]  352.97,214.57 0 bottom
R173  100  [1206]  358.56,214.57 0 bottom
R174  100  [1206]  393.89,58.89 90 bottom
R175  100  [1206]  392.62,63.84 0 bottom
R176  100  [1206]  231.35,143.89 90 bottom
R177  100  [1206]  408.65,214.83 90 bottom
R178  100  [1206]  412.97,214.57 0 bottom
R179  100  [1206]  418.56,214.57 0 bottom
R180  100  [1206]  233.89,143.89 90 bottom
R181  100  [1206]  232.62,148.84 0 bottom
R182  1k  [R0805]  297.18,83.19 90 bottom
R183  100  [1206]  40.17,183.65 0 bottom
R184  100  [1206]  40.43,187.97 270 bottom
R185  100  [1206]  40.43,193.56 270 bottom
R186  1k  [R0805]  67.94,87.25 0 bottom
R187  1k  [R0805]  67.94,89.53 0 bottom
R188  100  [1206]  181.35,73.89 90 bottom
R189  100  [1206]  40.17,213.65 0 bottom
R190  100  [1206]  40.43,217.97 270 bottom
R191  100  [1206]  40.43,223.56 270 bottom
R192  100  [1206]  183.89,73.89 90 bottom
R193  100  [1206]  182.62,78.84 0 bottom
R194  1k  [R0805]  199.26,232.92 0 bottom
R195  100  [1206]  40.17,243.65 0 bottom
R196  100  [1206]  40.43,247.97 270 bottom
R197  100  [1206]  40.43,253.56 270 bottom
R198  1k  [R0805]  199.26,238 0 bottom
R199  1k  [R0805]  295.66,229.11 270 bottom
R200  100  [1206]  231.35,73.89 90 bottom
R201  100  [1206]  233.89,73.89 90 bottom
R202  100  [1206]  232.62,78.84 0 bottom
R203  1k  [R0805]  293.62,229.11 270 bottom
R204  1k  [R0805]  392.94,227.84 180 bottom
R205  1k  [R0805]  392.94,225.68 180 bottom
RB1  470  [1206]  65,50 90 bottom
RB2  470  [1206]  75,150 90 bottom
RB3  470  [1206]  175,134.24 90 bottom
RB4  470  [1206]  75,100 90 bottom
RB5  470  [1206]  295,149.24 90 bottom
RB6  470  [1206]  85,50 90 bottom
RB8  470  [1206]  258.65,142.63 0 bottom
RB9  470  [1206]  271.86,142.51 180 bottom
RB10  470  [1206]  266.9,161.68 0 bottom
RB11  470  [1206]  193.65,142.63 0 bottom
RB12  470  [1206]  206.86,142.51 180 bottom
RB13  470  [1206]  201.91,161.68 0 bottom
RB14  470  [1206]  318.65,142.63 0 bottom
RB15  470  [1206]  331.86,142.51 180 bottom
RB16  470  [1206]  326.9,161.68 0 bottom
RB17  470  [1206]  193.65,112.63 0 bottom
RB18  470  [1206]  206.86,112.51 180 bottom
RB19  470  [1206]  201.91,131.68 0 bottom
RB20  470  [1206]  228.65,252.63 0 bottom
RB21  470  [1206]  241.86,252.51 180 bottom
RB22  470  [1206]  236.91,271.68 0 bottom
RB23  470  [1206]  193.65,72.63 0 bottom
RB24  470  [1206]  206.86,72.51 180 bottom
RB25  470  [1206]  201.91,91.68 0 bottom
RB26  470  [1206]  258.65,92.63 0 bottom
RB27  470  [1206]  271.86,92.51 180 bottom
RB28  470  [1206]  266.9,111.68 0 bottom
RB29  470  [1206]  193.65,42.63 0 bottom
RB30  470  [1206]  206.86,42.51 180 bottom
RB31  470  [1206]  201.91,61.68 0 bottom
RB32  470  [1206]  258.65,202.63 0 bottom
RB33  470  [1206]  271.86,202.51 180 bottom
RB34  470  [1206]  266.9,221.68 0 bottom
RB35  470  [1206]  288.65,92.63 0 bottom
RB36  470  [1206]  301.86,92.51 180 bottom
RB37  470  [1206]  296.9,111.68 0 bottom
RB38  470  [1206]  258.65,252.63 0 bottom
RB39  470  [1206]  271.86,252.51 180 bottom
RB40  470  [1206]  266.9,271.68 0 bottom
RB41  470  [1206]  318.65,92.63 0 bottom
RB42  470  [1206]  331.86,92.51 180 bottom
RB43  470  [1206]  326.9,111.68 0 bottom
RB44  470  [1206]  385,49.24 90 bottom
RB45  470  [1206]  225,134.24 90 bottom
RB47  470  [1206]  348.65,92.63 0 bottom
RB48  470  [1206]  361.86,92.51 180 bottom
RB49  470  [1206]  356.9,111.68 0 bottom
RB50  470  [1206]  288.65,252.63 0 bottom
RB51  470  [1206]  301.86,252.51 180 bottom
RB52  470  [1206]  296.9,271.68 0 bottom
RB53  470  [1206]  258.65,42.63 0 bottom
RB54  470  [1206]  271.86,42.51 180 bottom
RB55  470  [1206]  266.9,61.68 0 bottom
RB56  470  [1206]  288.65,202.63 0 bottom
RB57  470  [1206]  301.86,202.51 180 bottom
RB58  470  [1206]  297.03,221.81 0 bottom
RB59  470  [1206]  288.65,42.63 0 bottom
RB60  470  [1206]  301.86,42.51 180 bottom
RB61  470  [1206]  296.9,61.68 0 bottom
RB62  470  [1206]  318.65,252.63 0 bottom
RB63  470  [1206]  331.86,252.51 180 bottom
RB64  470  [1206]  326.9,271.68 0 bottom
RB65  470  [1206]  318.65,42.63 0 bottom
RB66  470  [1206]  331.86,42.51 180 bottom
RB67  470  [1206]  326.9,61.68 0 bottom
RB68  470  [1206]  175,64.24 90 bottom
RB70  470  [1206]  225,64.24 90 bottom
RB71  470  [1206]  348.65,42.63 0 bottom
RB72  470  [1206]  361.86,42.51 180 bottom
RB73  470  [1206]  356.9,61.68 0 bottom
RB74  470  [1206]  348.65,252.63 0 bottom
RB75  470  [1206]  361.86,252.51 180 bottom
RB76  470  [1206]  356.9,271.68 0 bottom
RB77  470  [1206]  198.65,252.63 0 bottom
RB78  470  [1206]  211.86,252.51 180 bottom
RB79  470  [1206]  206.91,271.68 0 bottom
RB80  470  [1206]  318.65,202.63 0 bottom
RB81  470  [1206]  331.86,202.51 180 bottom
RB82  470  [1206]  326.9,221.68 0 bottom
RB83  470  [1206]  378.65,252.63 0 bottom
RB84  470  [1206]  391.86,252.51 180 bottom
RB85  470  [1206]  386.9,271.68 0 bottom
RB89  470  [1206]  408.65,252.63 0 bottom
RB90  470  [1206]  421.86,252.51 180 bottom
RB91  470  [1206]  416.9,271.68 0 bottom
RB92  470  [1206]  348.65,202.63 0 bottom
RB93  470  [1206]  361.86,202.51 180 bottom
RB94  470  [1206]  356.9,221.68 0 bottom
RB98  470  [1206]  408.65,202.63 0 bottom
RB99  470  [1206]  421.86,202.51 180 bottom
RB100  470  [1206]  416.9,221.68 0 bottom
RB104  470  [1206]  52.37,183.65 270 bottom
RB105  470  [1206]  52.49,196.86 90 bottom
RB106  470  [1206]  33.32,191.91 270 bottom
RB110  470  [1206]  52.37,213.65 270 bottom
RB111  470  [1206]  52.49,226.86 90 bottom
RB112  470  [1206]  33.32,221.91 270 bottom
RB116  470  [1206]  52.37,243.65 270 bottom
RB117  470  [1206]  52.49,256.86 90 bottom
RB118  470  [1206]  33.32,251.91 270 bottom
RPD1  10k  [1206]  261.7,159.4 0 bottom
RPD2  10k  [1206]  196.7,159.4 0 bottom
RPD3  10k  [1206]  321.7,159.4 0 bottom
RPD4  10k  [1206]  196.7,129.4 0 bottom
RPD5  10k  [1206]  231.7,269.4 0 bottom
RPD6  10k  [1206]  196.7,89.4 0 bottom
RPD7  10k  [1206]  261.7,109.4 0 bottom
RPD8  10k  [1206]  196.7,59.4 0 bottom
RPD9  10k  [1206]  261.7,219.4 0 bottom
RPD10  10k  [1206]  291.7,109.4 0 bottom
RPD11  10k  [1206]  261.7,269.4 0 bottom
RPD12  10k  [1206]  321.7,109.4 0 bottom
RPD14  10k  [1206]  351.7,109.4 0 bottom
RPD15  10k  [1206]  291.7,269.4 0 bottom
RPD16  10k  [1206]  261.7,59.4 0 bottom
RPD17  10k  [1206]  291.7,219.4 0 bottom
RPD18  10k  [1206]  291.7,59.4 0 bottom
RPD19  10k  [1206]  321.7,269.4 0 bottom
RPD20  10k  [1206]  321.7,59.4 0 bottom
RPD22  10k  [1206]  351.7,59.4 0 bottom
RPD23  10k  [1206]  351.7,269.4 0 bottom
RPD24  10k  [1206]  201.7,269.4 0 bottom
RPD25  10k  [1206]  321.7,219.4 0 bottom
RPD26  10k  [1206]  381.7,269.4 0 bottom
RPD28  10k  [1206]  411.7,269.4 0 bottom
RPD29  10k  [1206]  351.7,219.4 0 bottom
RPD31  10k  [1206]  411.7,219.4 0 bottom
RPD33  10k  [1206]  35.6,186.7 270 bottom
RPD35  10k  [1206]  35.6,216.7 270 bottom
RPD37  10k  [1206]  35.6,246.7 270 bottom
S2  SWITCH-SKRKAEE020  [SKRKAEE020]  240.28,240.56 180 bottom
S24  [ENCODER_LED_3]  135,100 0 top
S31  [ENCODER_LED_3]  45,50 0 top
S32  B3F-1000  [B3F-1000]  65,50 0 top
S33  B3F-1000  [B3F-1000]  85,50 0 top
S34  [ENCODER_LED_3]  105,50 0 top
S35  [ENCODER_LED_3]  135,50 0 top
S_12  B3F-1000  [B3F-1000]  75,150 0 top
S_22  B3F-1000  [B3F-1000]  75,100 0 top
STLINK  75867-331LF  [MA03-2]  224.07,213.57 180 top
SW_42  B3F-1000  [B3F-1000]  175,135 0 top
SW_43  B3F-1000  [B3F-1000]  225,135 0 top
SW_46  B3F-1000  [B3F-1000]  175,65 0 top
SW_47  B3F-1000  [B3F-1000]  225,65 0 top
SW_52  B3F-1000  [B3F-1000]  295,150 0 top
SW_65  B3F-1000  [B3F-1000]  385,50 0 top
TFT_EXT  [MA06-2]  189.87,260.35 270 top
TFT_EXT_2  [MA06-2]  44.65,267.29 0 top
TLV75533  TLV75533PDBVR  [SOT95P280X145-5N]  223.38,237.89 180 bottom
UART_ANALOG  [MA03-1]  252.48,221.11 90 top
UART_DISCO  [MA03-1]  191.26,214.76 90 top
UART_MIDI  [MA03-1]  252.48,231.78 90 top

## Tracks (layer width: path | path; a pad name or v marks a point on that pad's centre or on a via)
3V3  (via drill 0.35)  (2 unrouted)
  Top 0.406: ENC_23.5 109,105.78 107.54,104.32 107.54,99.75 103.55,95.76 95.76,95.76 v95.38,95.38 | LED2.2 74,158.96 72.04,157 | 67.69,157 ENC_11.5 49,154.72 40.08,145.8 40.08,118.8 49,109.88 ENC_21.5 | 67.69,157 72.04,157 | 72.04,157 89.94,157 92.2,159.26 108.08,159.26 109,158.34 ENC_13.5 127.16,157 129.41,159.26 138.18,159.26 139,158.43 ENC_14.5 | 137.16,109.73 126.75,109.73 123.95,106.93 v116.84,106.93 | 137.16,109.73 139,107.89 S24.5 | 137.16,109.73 v147.32,109.73 157.73,99.31 v157.73,70.99 | LED1.2 67.72,63.88 | LED6.2 84,62.69 82.8,63.88 | 67.72,63.88 82.8,63.88 | 67.72,63.88 64.64,63.88 | 64.64,63.88 53.85,63.88 49,59.03 S31.5 | 82.8,63.88 107.82,63.88 | S34.5 109,62.7 107.82,63.88 | 107.82,63.88 138.18,63.88 139,63.06 139,62.48 | 139,62.48 S35.5 | 64.64,63.88 64.64,81.53 v65.66,82.55 | STLINK.1 226.65,214.88 227.84,214.88 v229.62,213.11 229.62,212.98 CONN_STH_BRD_1.4 | v239.27,225.35 v239.27,224.01 v239.26,224 | v279.91,55.12 297.12,55.12 ENC_62.5 | v309.25,55.24 328.3,55.24 329,55.95 ENC_63.5 | v337.69,55.12 341.5,55.12 | 341.5,55.12 358.27,55.12 359,55.85 ENC_64.5 | ENC_57.5 359,105.76 357.5,104.27 348.36,104.27 345.63,107 ENC_56.5 326.14,104.14 316.61,104.14 313.75,107 ENC_55.5 299,105.33 297.69,104.01 283.21,104.01 280.22,107 ENC_54.5 269,107.89 266.78,110.11 248.41,110.11 240.16,101.85 v240.16,101.73 240.16,98.3 | ENC_51.5 293.02,157 | LED4.2 294,157.98 293.02,157 | 293.02,157 298.07,157 299.82,158.75 328.3,158.75 329,158.04 ENC_53.5 | 358.01,213.49 359,214.47 ENC_74.5 | 419,216.79 ENC_75.5 | 419,216.79 423.42,221.21 423.42,262.58 ENC_88.5 416.63,269.37 391.37,269.37
  Top 0.406: ENC_87.5 391.37,269.37 | ENC_81.5 210.48,268.48 | 210.48,268.48 237.52,268.48 ENC_82.5 240.22,268.22 267.78,268.22 ENC_83.5 270.22,268.22 297.78,268.22 ENC_84.5 300.22,268.22 327.78,268.22 ENC_85.5 330.22,265.78 357.78,265.78 ENC_86.5 376.35,267 378.71,269.37 391.37,269.37 | ENC_3.5 38.76,254 40.97,251.79 40.97,226.97 ENC_02.5 39.22,222.78 39.22,195.22 ENC_01.5 | LED_43.2 224,145.95 212.95,157 ENC_41.5 204,157.44 203.07,158.37 187.21,158.37 LED_42.2 | 224,77.24 LED_47.2 | 224,77.24 214.24,87 ENC_45.5 204.89,87.89 204.89,115.48 203.83,116.54 199.86,116.54 199.56,116.85 199.56,122.56 199.98,122.98 | v212.47,137.67 212.47,129.92 v210.69,128.14 | ENC_44.5 199.98,122.98 | ENC_51.5 269,152.19 267.21,150.4 267.21,146.55 269.37,144.4 | v365.63,102.11 365.63,90.81 341.5,66.67 341.5,55.12 | 240.16,98.3 240.16,93.73 224,77.57 224,77.24 | v291.78,124.52 291.78,127.95 v291.72,128.02 | v309.75,89.53 309.75,89.41 316.23,82.93 v316.23,80.39 316.23,79.63 312.42,75.82 v306.07,75.82 | v309.75,94.61 309.5,94.87 v309.5,99.95 | 240.16,98.3 v229.11,98.3 | v207.9,235.46 207.65,235.71 207.65,239.9 207.01,240.54 v205.49,240.54 192.66,240.54 186.56,246.63 186.56,264.67 TFT_EXT.1 190.37,268.48 210.48,268.48 | v207.9,235.46 199.14,235.46 v198.37,234.7 | 419,216.79 415.19,212.98 402.92,212.98 | 358.01,213.49 367.97,213.49 371.99,209.47 399.41,209.47 402.92,212.98 | ENC_72.5 298.96,217.04 298.96,223.39 300.61,225.04 303.02,225.04 | 303.02,225.04 326.39,225.04 329,222.43 ENC_73.5 332.51,213.49 358.01,213.49 | v388.24,218.57 393.83,212.98 402.92,212.98 | 303.02,225.04 300.78,227.29 295.54,227.29 294.94,226.69 v293.62,226.69 278.69,226.69 ENC_71.5
  Top 0.406: CONN_STH_BRD_1.4 CONN_STH_BRD_1.2 | 222.76,206.12 CONN_STH_BRD_1.4 | v256.41,160.15 265.85,160.15 ENC_51.5 | v242.82,214.12 242.82,216.28 v242.19,216.92 | v207.9,235.46 207.9,233.43 215.9,225.43 v224.92,225.43 | v141.22,62.61 141.1,62.48 139,62.48 | 67.69,157 v67.69,133.48 | v67.69,119.38 67.69,118.24 74,111.93 LED22.2 | 199.98,122.98 183.05,122.98 v181.48,121.41
  Bottom 0.305: 234.59,224 233.22,225.37 F446.1 C71.2 | 234.59,224 v239.26,224 241.29,224 241.3,224.01 F446.19 245.55,224.01 246.45,224.91 | 233.22,213.34 233.22,213.49 | 233.22,213.49 233.22,215.52 | 233.22,215.52 F446.48 | C70.2 229.24,227.81 | C65.+ 228.22,230.66 229.24,229.64 229.24,227.81 | F446.64 229.92,225.01 229.24,225.69 229.24,227.81 | 239.22,225.4 F446.13 239.22,228.18 240.67,229.63 | v229.62,213.11 232.03,215.52 233.22,215.52 | F446.32 241.6,217.51 | 241.6,217.51 238.81,217.51 234.59,221.73 234.59,224 | v242.19,216.92 241.6,217.51 | 233.22,213.49 233.24,213.47 C66.2
  Bottom 0.406: L1.2 229.63,234.43 C65.+ 228.78,233.02 231.92,229.88 C71.2 | R79.1 240.67,232.01 C68.2 240.67,229.63 | 239.22,224.04 v239.26,224 | 246.45,224.91 C69.2 | C70.2 226.06,227.81 R95.1 225.22,225.73 v224.92,225.43 | MCP_000.9 124.77,131.64 R4.2 126.3,134.18 126.53,134.41 131.66,134.41 132.14,133.92 R5.2 134.3,133.16 134.81,132.65 | ENC_11.5 51.21,157 52.35,155.86 CDEC_9.1 52.35,153.54 51.1,152.29 49.32,152.29 48.05,151.02 48.05,148.73 47.54,148.22 43.98,148.22 43.09,147.33 PIXEL_11.8 | ENC_13.5 111.21,157 111.86,156.35 111.86,154.81 | ENC_14.5 141.21,157 141.86,156.35 141.86,153.05 | 141.86,153.05 141.1,152.29 140.17,152.29 138.05,150.17 138.05,150.01 136.39,148.35 135.14,148.35 133.09,146.31 PIXEL_14.8 | ENC_21.5 51.21,107 51.86,106.35 51.86,103.05 51.1,102.29 49.32,102.29 48.05,101.02 48.05,98.73 47.79,98.48 | 47.79,98.48 47.54,98.22 44.88,98.22 43.09,96.43 PIXEL_21.8 CDEC_12.1 | ENC_23.5 111.21,107 111.45,106.75 | 111.45,106.75 111.86,106.35 111.86,103.05 111.1,102.29 109.32,102.29 108.05,101.02 108.05,98.73 107.54,98.22 103.98,98.22 103.09,97.33 PIXEL_23.8 CDEC_7.1 | S24.5 141.21,107 141.86,106.35 141.86,103.05 141.1,102.29 139.32,102.29 138.05,101.02 138.05,98.73 137.54,98.22 133.98,98.22 133.09,97.33 PIXEL_24.8 132.97,95.63 CDEC_6.1 | PIXEL_34.8 103.09,47.33 103.6,47.84 113.51,47.84 115.03,49.37 115.03,56.35 114.38,57 113.16,57 CDEC_4.1 109.25,56.74 S34.5 | PIXEL_35.8 133.09,47.33 133.98,48.22 137.83,48.22 139.06,46.99 142.24,46.99 145.54,50.29 145.54,54.48 144.78,55.24 143.66,55.24 CDEC_5.1 143.64,56.52 143.15,57 S35.5 | LED2.2 74,158.63 69.92,154.56 69.92,146.19 70.56,145.56 80.72,145.56 81.35,146.19 PIXEL_12.8 81.35,149.42 82.55,150.62 87.35,150.62 CDEC_10.1
  Bottom 0.406: LED22.2 74,108.64 70.23,104.86 70.23,95.88 | 80.72,95.56 81.35,96.19 PIXEL_22.8 81.35,99.26 82.7,100.61 86.87,100.61 CDEC_8.1 | 80.72,95.56 70.56,95.56 70.23,95.88 | LED6.2 84,58.63 79.92,54.55 79.92,48.9 | 91.35,48.36 PIXEL_33.8 91.35,46.19 90.72,45.55 80.56,45.55 79.92,46.19 79.92,48.9 | LED1.2 64,59.52 56.74,52.27 56.74,49.66 57.74,48.66 CDEC_1.1 59.05,46.22 59.85,45.43 69.92,45.43 71.35,46.86 PIXEL_32.8 71.35,48.36 | 134.81,132.65 135,132.46 CDEC_11B.1 137.6,125.95 139.8,128.15 CDEC_11A.+ 147.32,120.83 | v95.38,95.38 81.92,95.38 | 81.92,95.38 80.89,95.38 80.72,95.56 | CDEC_2.1 79.77,49.05 79.92,48.9 | 81.92,95.38 82.65,94.64 MCP_001.15 84.84,89.78 85.15,89.48 CDEC_12B.1 87.33,90.41 CDEC_12A.+ | 47.79,98.48 49.75,96.52 51.69,96.52 v65.66,82.55 | v116.84,106.93 111.63,106.93 111.45,106.75 | CDEC_3.1 42.16,45.72 42.37,45.51 PIXEL_31.8 43.09,46.56 44.76,48.22 46.26,48.22 48.05,50.01 48.05,50.4 51.19,53.53 51.19,55.61 49.8,57 S31.5 | CDEC_11.1 113.79,151.87 113.79,153.42 112.39,154.81 111.86,154.81 | 141.86,153.05 141.86,151.49 CDEC_13.1 156.36,148.44 162.43,142.37 | 239.22,225.4 v239.27,225.35 | ENC_41.5 206.21,157 206.86,156.35 | 206.86,156.35 206.86,153.05 206.1,152.29 204.32,152.29 203.05,151.02 203.05,148.73 | 203.05,148.73 202.54,148.22 198.98,148.22 198.09,147.33 PIXEL_41.8 | CPOL2.1 204.32,147.71 203.3,148.73 203.05,148.73 | 206.86,156.35 206.99,156.35 208.03,155.31 CDEC2.+ 210.67,156.95 212.34,158.62 CONN_STH_BRD_2.2 CONN_STH_BRD_2.4 223.52,159.77 229.77,159.77 229.82,159.72 255.98,159.72 v256.41,160.15 | ENC_44.5 206.21,127 206.86,126.35
  Bottom 0.406: 206.86,126.35 206.86,123.05 206.1,122.29 204.32,122.29 203.05,121.02 203.05,118.73 | 203.05,118.73 202.54,118.22 198.98,118.22 198.09,117.33 PIXEL_44.8 | CPOL4.1 204.32,117.71 203.3,118.73 203.05,118.73 | 206.86,126.35 206.99,126.35 208.03,125.31 CDEC4.+ 210.69,125.33 v210.69,128.14 | ENC_45.5 206.21,87 206.86,86.35 | 206.86,86.35 206.86,83.05 206.1,82.29 204.32,82.29 203.05,81.02 203.05,78.73 | 203.05,78.73 202.54,78.22 198.98,78.22 198.09,77.33 PIXEL_45.8 | CPOL6.1 204.32,77.71 203.3,78.73 203.05,78.73 | 206.86,86.35 206.99,86.35 208.03,85.31 CDEC6.+ 211.62,85.31 219.67,77.26 CDEC39.1 | ENC_48.5 206.21,57 | 206.86,56.35 206.86,53.05 206.1,52.29 204.32,52.29 203.05,51.02 203.05,48.73 | 203.05,48.73 202.54,48.22 198.98,48.22 198.09,47.33 PIXEL_48.8 | 206.86,56.35 206.21,57 | CPOL8.1 204.32,47.71 203.3,48.73 203.05,48.73 | CDEC8.+ 210.44,55.31 | 210.44,55.31 208.03,55.31 206.99,56.35 206.86,56.35 | ENC_51.5 271.21,157 271.86,156.35 | 271.86,156.35 271.86,153.05 271.1,152.29 269.32,152.29 268.05,151.02 268.05,148.73 | 268.05,148.73 267.54,148.22 263.98,148.22 263.1,147.33 PIXEL_51.8 | CPOL1.1 269.32,147.71 268.3,148.73 268.05,148.73 | CDEC1.+ 273.03,155.31 271.99,156.35 271.86,156.35 | ENC_53.5 331.21,157 331.86,156.35 | 331.86,156.35 331.86,153.05 331.1,152.29 329.32,152.29 328.05,151.02 328.05,148.73 | 328.05,148.73 327.54,148.22 323.98,148.22 323.1,147.33 PIXEL_53.8 | CPOL3.1 329.32,147.71 328.3,148.73 328.05,148.73 | 331.86,156.35 331.99,156.35 333.03,155.31 CDEC3.+ 365.67,125.31 CDEC14.+ | ENC_54.5 271.21,107 271.86,106.35 | 271.86,106.35 271.86,103.05 271.1,102.29 269.32,102.29 268.05,101.02 268.05,98.73
  Bottom 0.406: 268.05,98.73 267.54,98.22 263.98,98.22 263.1,97.33 PIXEL_54.8 | CPOL7.1 269.32,97.71 268.3,98.73 268.05,98.73 | CDEC7.+ 273.03,105.31 271.99,106.35 271.86,106.35 | 301.86,106.35 301.86,103.05 301.1,102.29 299.32,102.29 298.05,101.02 298.05,98.73 | 298.05,98.73 297.54,98.22 293.98,98.22 293.1,97.33 PIXEL_55.8 | 301.86,106.35 301.21,107 ENC_55.5 299.97,107.97 299.97,114.17 296.8,117.35 | CPOL10.1 299.32,97.71 298.3,98.73 298.05,98.73 | 301.86,106.35 301.99,106.35 303.03,105.31 CDEC10.+ 305.67,103.78 v309.5,99.95 | ENC_56.5 331.21,107 331.86,106.35 | 331.86,106.35 331.86,103.05 331.1,102.29 329.32,102.29 328.05,101.02 328.05,98.73 | 328.05,98.73 327.54,98.22 323.98,98.22 323.1,97.33 PIXEL_56.8 | CDEC12.+ 333.03,105.31 331.99,106.35 331.86,106.35 | ENC_57.5 361.21,107 361.86,106.35 | 361.86,106.35 361.86,103.05 361.1,102.29 359.32,102.29 358.05,101.02 358.05,98.73 | 358.05,98.73 357.54,98.22 353.98,98.22 353.1,97.33 PIXEL_57.8 | CPOL14.1 359.32,97.71 358.3,98.73 358.05,98.73 | CDEC14.+ 363.03,105.31 361.99,106.35 361.86,106.35 | ENC_61.5 271.21,57 271.86,56.35 | 271.86,56.35 271.86,53.05 271.1,52.29 269.32,52.29 268.05,51.02 268.05,48.73 | 268.05,48.73 267.54,48.22 263.98,48.22 263.1,47.33 PIXEL_61.8 | CPOL16.1 269.32,47.71 268.3,48.73 268.05,48.73 | 271.86,56.35 271.99,56.35 273.03,55.31 CDEC16.+ 275.86,55.12 v279.91,55.12 | ENC_62.5 301.21,57 301.86,56.35 | 301.86,56.35 301.86,53.05 301.1,52.29 299.32,52.29 298.05,51.02 298.05,48.73 | 298.05,48.73 297.54,48.22 293.98,48.22 293.1,47.33 PIXEL_62.8 | CPOL18.1 299.32,47.71 298.3,48.73 298.05,48.73 | 301.86,56.35 301.99,56.35 303.03,55.31 CDEC18.+ 309.18,55.31 v309.25,55.24
  Bottom 0.406: ENC_63.5 331.21,57 331.86,56.35 | 331.86,56.35 331.86,53.05 331.1,52.29 329.32,52.29 328.05,51.02 328.05,48.73 | 328.05,48.73 327.54,48.22 323.98,48.22 323.1,47.33 PIXEL_63.8 | CPOL20.1 329.32,47.71 328.3,48.73 328.05,48.73 | 331.86,56.35 331.99,56.35 333.03,55.31 CDEC20.+ 337.5,55.31 v337.69,55.12 | ENC_64.5 361.21,57 361.86,56.35 | 361.86,56.35 361.86,53.05 361.1,52.29 359.32,52.29 358.05,51.02 358.05,48.73 | 358.05,48.73 357.54,48.22 353.98,48.22 353.1,47.33 PIXEL_64.8 | CPOL22.1 359.32,47.71 358.3,48.73 358.05,48.73 | 361.86,56.35 361.99,56.35 363.03,55.31 CDEC22.+ 372.05,55.31 374.01,53.34 377.82,53.34 CPOL30.+ 377.89,57.62 378.33,58.06 CDEC30.1 | ENC_81.5 211.21,267 211.22,266.99 | 211.22,266.99 211.22,263.43 210.08,262.29 209.32,262.29 208.05,261.02 208.05,258.73 | 208.05,258.73 207.54,258.22 203.98,258.22 203.09,257.33 PIXEL_81.8 | 211.22,266.99 211.86,266.35 211.99,266.35 213.03,265.31 CDEC24.+ | CPOL24.1 209.32,257.71 208.3,258.73 208.05,258.73 | ENC_82.5 241.21,267 241.22,266.99 | 241.22,266.99 241.22,263.43 240.08,262.29 239.32,262.29 238.05,261.02 238.05,258.73 | 238.05,258.73 237.54,258.22 233.98,258.22 233.09,257.33 PIXE_82.8 | 241.22,266.99 241.86,266.35 241.99,266.35 243.03,265.31 CDEC5.+ | CPOL5.1 239.32,257.71 238.3,258.73 238.05,258.73 | ENC_83.5 271.21,267 271.22,266.99 | 271.22,266.99 271.22,263.56 269.95,262.29 269.32,262.29 268.05,261.02 268.05,258.73 | 268.05,258.73 267.54,258.22 263.98,258.22 263.1,257.33 PIXEL_83.8 | 271.22,266.99 271.86,266.35 271.99,266.35 273.03,265.31 CDEC11.+ | CPOL11.1 269.32,257.71 268.3,258.73 268.05,258.73